# Altium schematic sheet CommonBoard_FK_H743.SchDoc
size A3
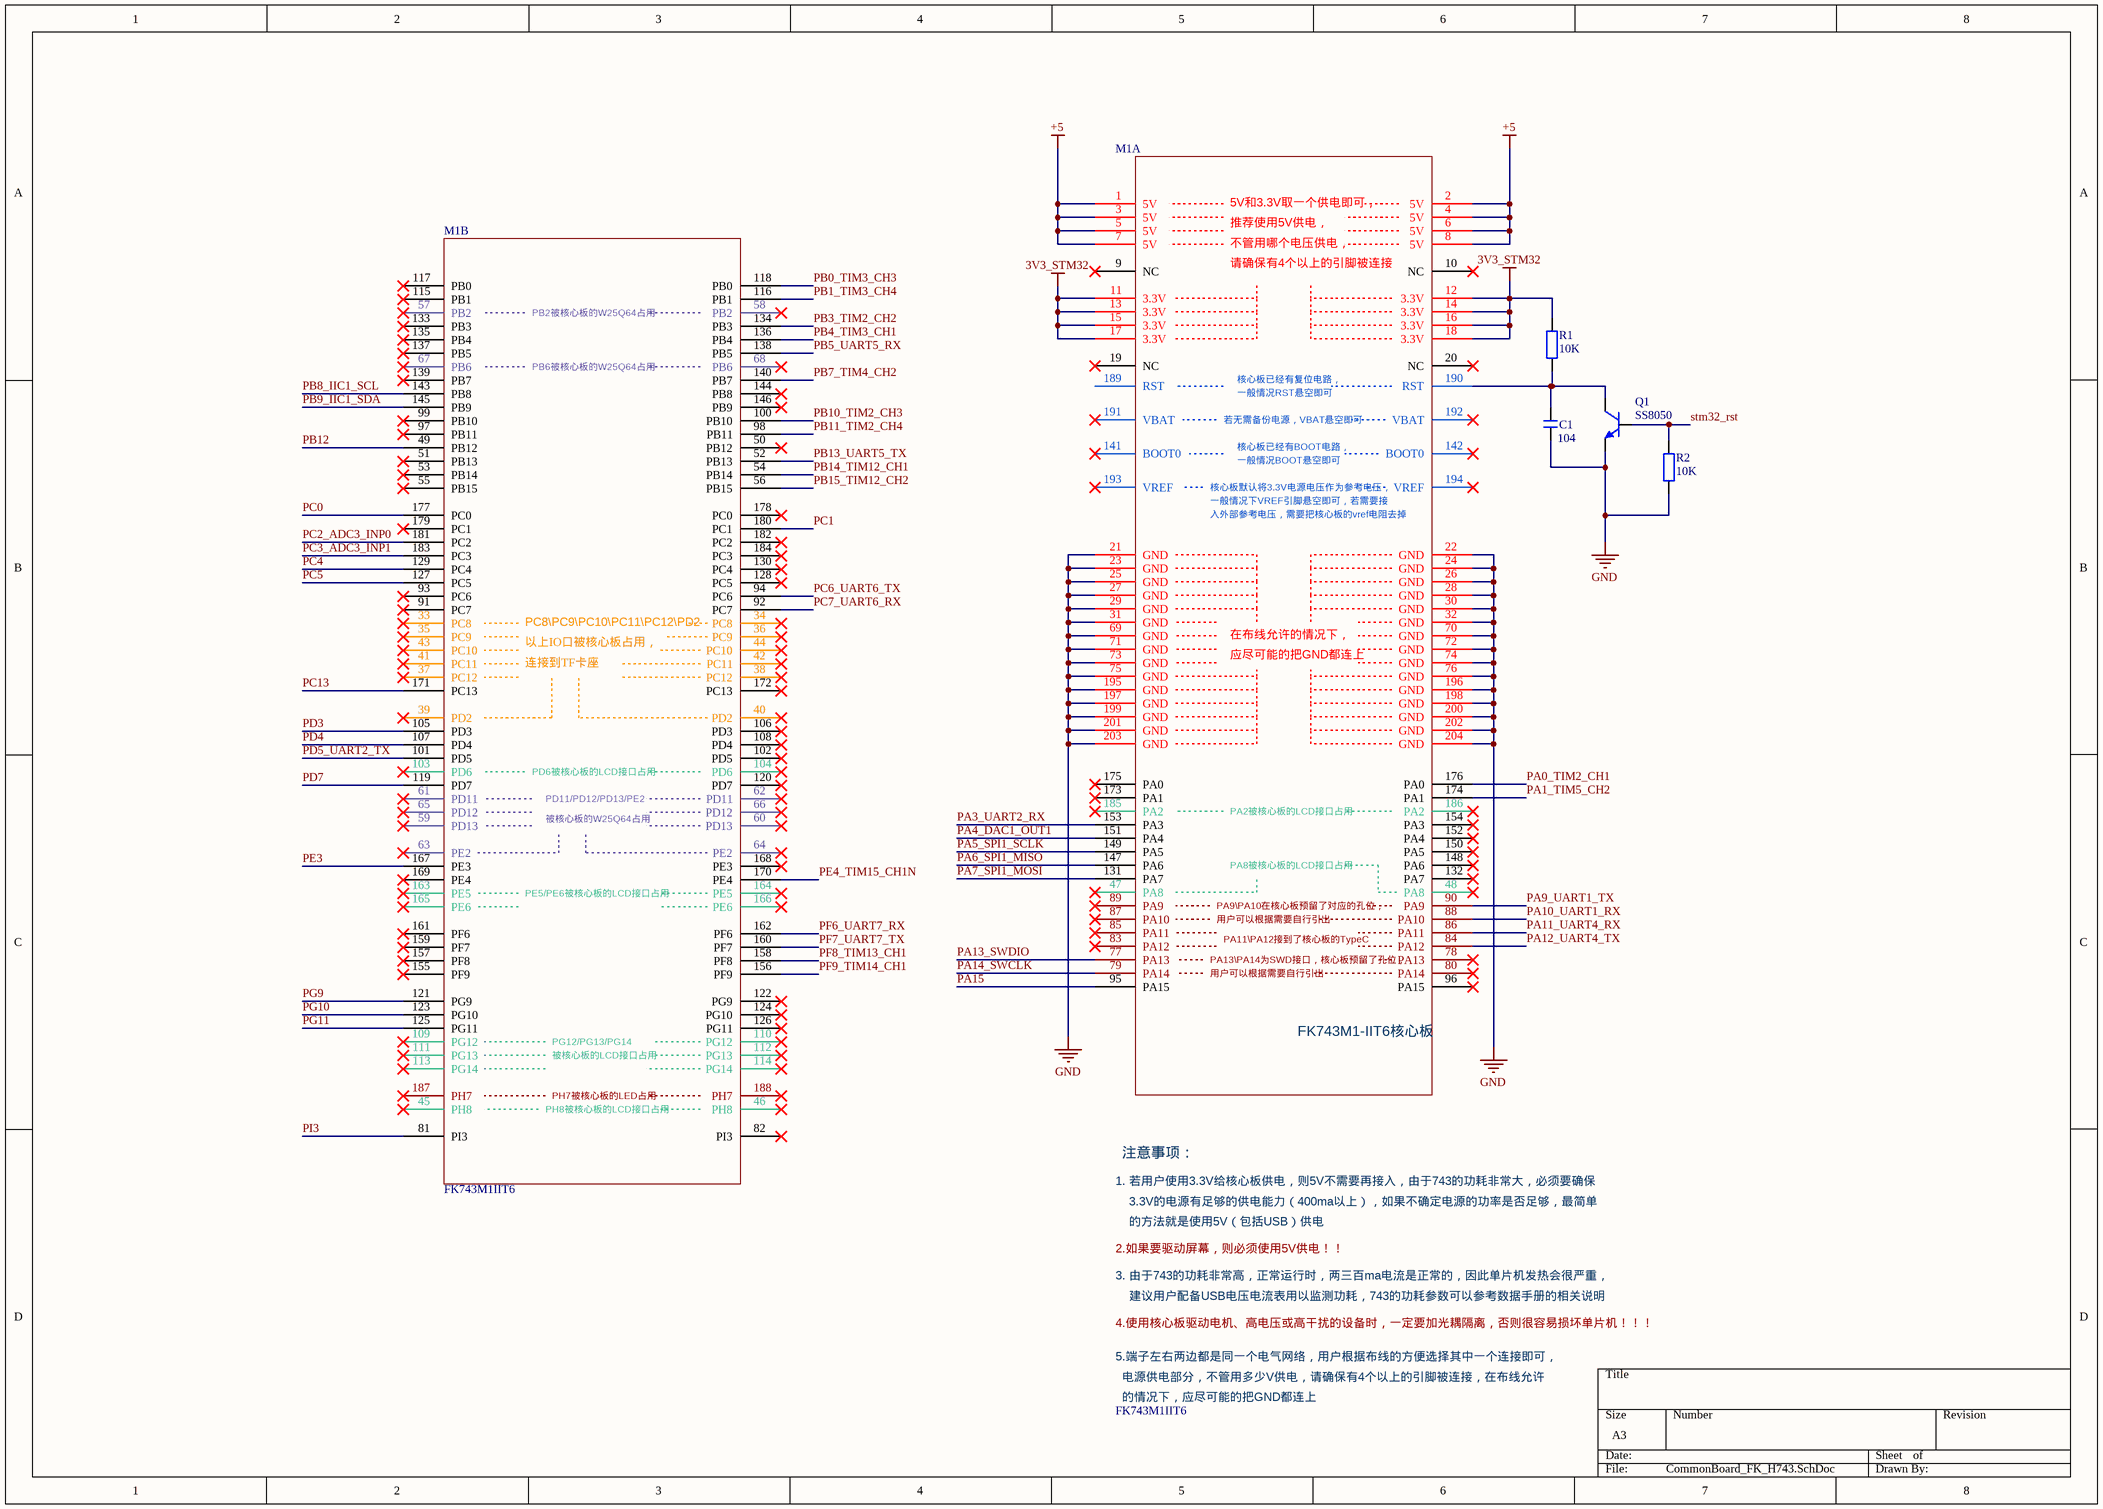
[diagram p0: CommonBoard_FK_H743.SchDoc]

## Parts
C1  104  [C 0603_L]
M1  FK743M1IIT6  [FK743M1-IIT6]  (parts A,B of 2)
Q1  SS8050  [SOT23-3N]
R1  10K  [R 0603_L]
R2  10K  [R 0603_L]

## Nets
3V3_STM32: M1.11(3.3V) M1.12(3.3V) M1.13(3.3V) M1.14(3.3V) M1.15(3.3V) M1.16(3.3V) M1.17(3.3V) M1.18(3.3V) R1.2
+5: M1.1(5V) M1.2(5V) M1.3(5V) M1.4(5V) M1.5(5V) M1.6(5V) M1.7(5V) M1.8(5V)
GND: C1.1 M1.21(GND) M1.22(GND) M1.23(GND) M1.24(GND) M1.25(GND) M1.26(GND) M1.27(GND) M1.28(GND) M1.29(GND) M1.30(GND) M1.31(GND) M1.32(GND) M1.69(GND) M1.70(GND) M1.71(GND) M1.72(GND) M1.73(GND) M1.74(GND) M1.75(GND) M1.76(GND) M1.195(GND) M1.196(GND) M1.197(GND) M1.198(GND) M1.199(GND) M1.200(GND) M1.201(GND) M1.202(GND) M1.203(GND) M1.204(GND) Q1.2(E) R2.1
PA0_TIM2_CH1: M1.176(PA0)
PA1_TIM5_CH2: M1.174(PA1)
PA3_UART2_RX: M1.153(PA3)
PA4_DAC1_OUT1: M1.151(PA4)
PA5_SPI1_SCLK: M1.149(PA5)
PA6_SPI1_MISO: M1.147(PA6)
PA7_SPI1_MOSI: M1.131(PA7)
PA9_UART1_TX: M1.90(PA9)
PA10_UART1_RX: M1.88(PA10)
PA11_UART4_RX: M1.86(PA11)
PA12_UART4_TX: M1.84(PA12)
PA13_SWDIO: M1.77(PA13)
PA14_SWCLK: M1.79(PA14)
PA15: M1.95(PA15)
PB0_TIM3_CH3: M1.118(PB0)
PB1_TIM3_CH4: M1.116(PB1)
PB3_TIM2_CH2: M1.134(PB3)
PB4_TIM3_CH1: M1.136(PB4)
PB5_UART5_RX: M1.138(PB5)
PB7_TIM4_CH2: M1.140(PB7)
PB8_IIC1_SCL: M1.143(PB8)
PB9_IIC1_SDA: M1.145(PB9)
PB10_TIM2_CH3: M1.100(PB10)
PB11_TIM2_CH4: M1.98(PB11)
PB12: M1.49(PB12)
PB13_UART5_TX: M1.52(PB13)
PB14_TIM12_CH1: M1.54(PB14)
PB15_TIM12_CH2: M1.56(PB15)
PC0: M1.177(PC0)
PC1: M1.180(PC1)
PC2_ADC3_INP0: M1.181(PC2)
PC3_ADC3_INP1: M1.183(PC3)
PC4: M1.129(PC4)
PC5: M1.127(PC5)
PC6_UART6_TX: M1.94(PC6)
PC7_UART6_RX: M1.92(PC7)
PC13: M1.171(PC13)
PD3: M1.105(PD3)
PD4: M1.107(PD4)
PD5_UART2_TX: M1.101(PD5)
PD7: M1.119(PD7)
PE3: M1.167(PE3)
PE4_TIM15_CH1N: M1.170(PE4)
PF6_UART7_RX: M1.162(PF6)
PF7_UART7_TX: M1.160(PF7)
PF8_TIM13_CH1: M1.158(PF8)
PF9_TIM14_CH1: M1.156(PF9)
PG9: M1.121(PG9)
PG10: M1.123(PG10)
PG11: M1.125(PG11)
PI3: M1.81(PI3)
stm32_rst: Q1.1(B) R2.2
NetC1_2: C1.2 M1.190(RST) Q1.3(C) R1.1

Not connected (* = marked no-connect by the designer): M1 9(NC)* 10(NC)* 19(NC)* 20(NC)* 33(PC8)* 34(PC8)* 35(PC9)* 36(PC9)* 37(PC12)* 38(PC12)* 39(PD2)* 40(PD2)* 41(PC11)* 42(PC11)* 43(PC10)* 44(PC10)* 45(PH8)* 46(PH8)* 47(PA8)* 48(PA8)* 50(PB12)* 51(PB13)* 53(PB14)* 55(PB15)* 57(PB2)* 58(PB2)* 59(PD13)* 60(PD13)* 61(PD11)* 62(PD11)* 63(PE2)* 64(PE2)* 65(PD12)* 66(PD12)* 67(PB6)* 68(PB6)* 78(PA13)* 80(PA14)* 82(PI3)* 83(PA12)* 85(PA11)* 87(PA10)* 89(PA9)* 91(PC7)* 93(PC6)* 96(PA15)* 97(PB11)* 99(PB10)* 102(PD5)* 103(PD6)* 104(PD6)* 106(PD3)* 108(PD4)* 109(PG12)* 110(PG12)* 111(PG13)* 112(PG13)* 113(PG14)* 114(PG14)* 115(PB1)* 117(PB0)* 120(PD7)* 122(PG9)* 124(PG10)* 126(PG11)* 128(PC5)* 130(PC4)* 132(PA7)* 133(PB3)* 135(PB4)* 137(PB5)* 139(PB7)* 141(BOOT0)* 142(BOOT0)* 144(PB8)* 146(PB9)* 148(PA6)* 150(PA5)* 152(PA4)* 154(PA3)* 155(PF9)* 157(PF8)* 159(PF7)* 161(PF6)* 163(PE5)* 164(PE5)* 165(PE6)* 166(PE6)* 168(PE3)* 169(PE4)* 172(PC13)* 173(PA1)* 175(PA0)* 178(PC0)* 179(PC1)* 182(PC2)* 184(PC3)* 185(PA2)* 186(PA2)* 187(PH7)* 188(PH7)* 189(RST) 191(VBAT)* 192(VBAT)* 193(VREF)* 194(VREF)*

## Notes on the sheet
- (in symbol FK743M1-IIT6, part A) 5V和3.3V取一个供电即可，; 推荐使用5V供电，; 不管用哪个电压供电，; 请确保有4个以上的引脚被连接; 核心板已经有复位电路，; 一般情况RST悬空即可; 若无需备份电源，VBAT悬空即可; 核心板已经有BOOT电路，; 一般情况BOOT悬空即可; 核心板默认将3.3V电源电压作为参考电压，; 一般情况下VREF引脚悬空即可，若需要接; 入外部参考电压，需要把核心板的vref电阻去掉; 在布线允许的情况下，; 应尽可能的把GND都连上; PA2被核心板的LCD接口占用; PA8被核心板的LCD接口占用; PA9\PA10在核心板预留了对应的孔位，; 用户可以根据需要自行引出; PA11\PA12接到了核心板的TypeC; PA13\PA14为SWD接口，核心板预留了孔位，; FK743M1-IIT6核心板; 注意事项：; 1. 若用户使用3.3V给核心板供电，则5V不需要再接入，由于743的功耗非常大，必须要确保; 3.3V的电源有足够的供电能力（400ma以上），如果不确定电源的功率是否足够，最简单; 的方法就是使用5V（包括USB）供电; 2.如果要驱动屏幕，则必须使用5V供电！！; 3. 由于743的功耗非常高，正常运行时，两三百ma电流是正常的，因此单片机发热会很严重，; 建议用户配备USB电压电流表用以监测功耗，743的功耗参数可以参考数据手册的相关说明; 4.使用核心板驱动电机、高电压或高干扰的设备时，一定要加光耦隔离，否则很容易损坏单片机！！！; 5.端子左右两边都是同一个电气网络，用户根据布线的方便选择其中一个连接即可，; 电源供电部分，不管用多少V供电，请确保有4个以上的引脚被连接，在布线允许; 的情况下，应尽可能的把GND都连上
- (in symbol FK743M1-IIT6, part B) PB2被核心板的W25Q64占用; PB6被核心板的W25Q64占用; PC8\PC9\PC10\PC11\PC12\PD2; 以上IO口被核心板占用，; 连接到TF卡座; PD6被核心板的LCD接口占用; PD11/PD12/PD13/PE2; 被核心板的W25Q64占用; PE5/PE6被核心板的LCD接口占用; PG12/PG13/PG14; 被核心板的LCD接口占用; PH7被核心板的LED占用; PH8被核心板的LCD接口占用

## Library data of the parts
C1 = C: 无极性贴片电容; 版权归属: 源创客; BOM名称: 无极性贴片电容; 学习资源: www.ooocke.com
M1 = FK743M1-IIT6
Q1 = 8050-SMD: 高频放大-NPN型; 版权归属: 源创客; 属性: 40V 1.5A 1W 100MHZ; BOM名称: 高频放大-NPN型; 学习资源: www.ooocke.com
R1 R2 = R: 贴片电阻; 版权归属: 源创客; BOM名称: 贴片电阻; 学习资源: www.ooocke.com